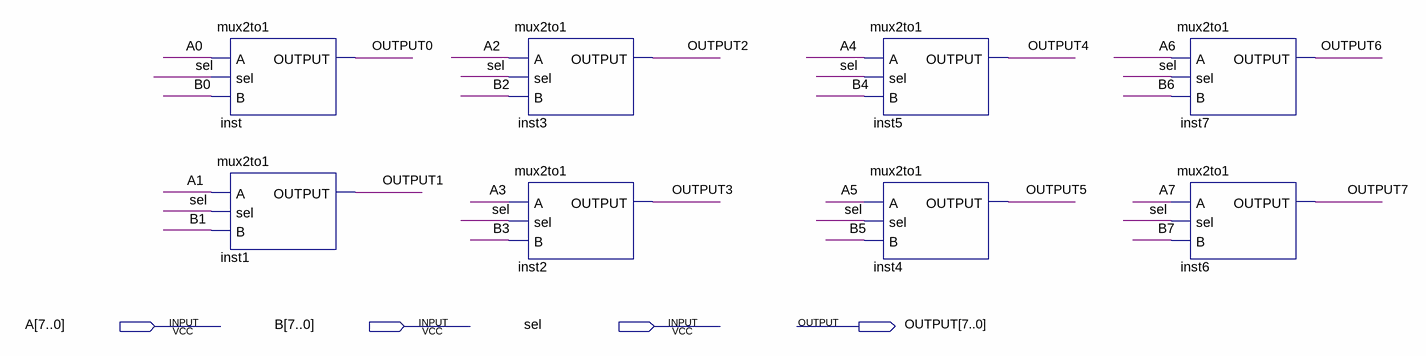
[diagram p0: schematic sheet]
// Quartus schematic mux2to1_8bits.bdf as structural Verilog: 8 symbols, 4 pins
module mux2to1_8bits (
  input  [7:0] A,
  input  [7:0] B,
  input  sel,
  output [7:0] OUTPUT
);

  mux2to1 inst (.A(A[0]), .sel(sel), .B(B[0]), .OUTPUT(OUTPUT[0]));
  mux2to1 inst1 (.A(A[1]), .sel(sel), .B(B[1]), .OUTPUT(OUTPUT[1]));
  mux2to1 inst3 (.A(A[2]), .sel(sel), .B(B[2]), .OUTPUT(OUTPUT[2]));
  mux2to1 inst2 (.A(A[3]), .sel(sel), .B(B[3]), .OUTPUT(OUTPUT[3]));
  mux2to1 inst5 (.A(A[4]), .sel(sel), .B(B[4]), .OUTPUT(OUTPUT[4]));
  mux2to1 inst4 (.A(A[5]), .sel(sel), .B(B[5]), .OUTPUT(OUTPUT[5]));
  mux2to1 inst7 (.A(A[6]), .sel(sel), .B(B[6]), .OUTPUT(OUTPUT[6]));
  mux2to1 inst6 (.A(A[7]), .sel(sel), .B(B[7]), .OUTPUT(OUTPUT[7]));
endmodule
